# EAGLE schematic dcy.vca.v1.0.0 (EAGLE 7.7.0)
VCA
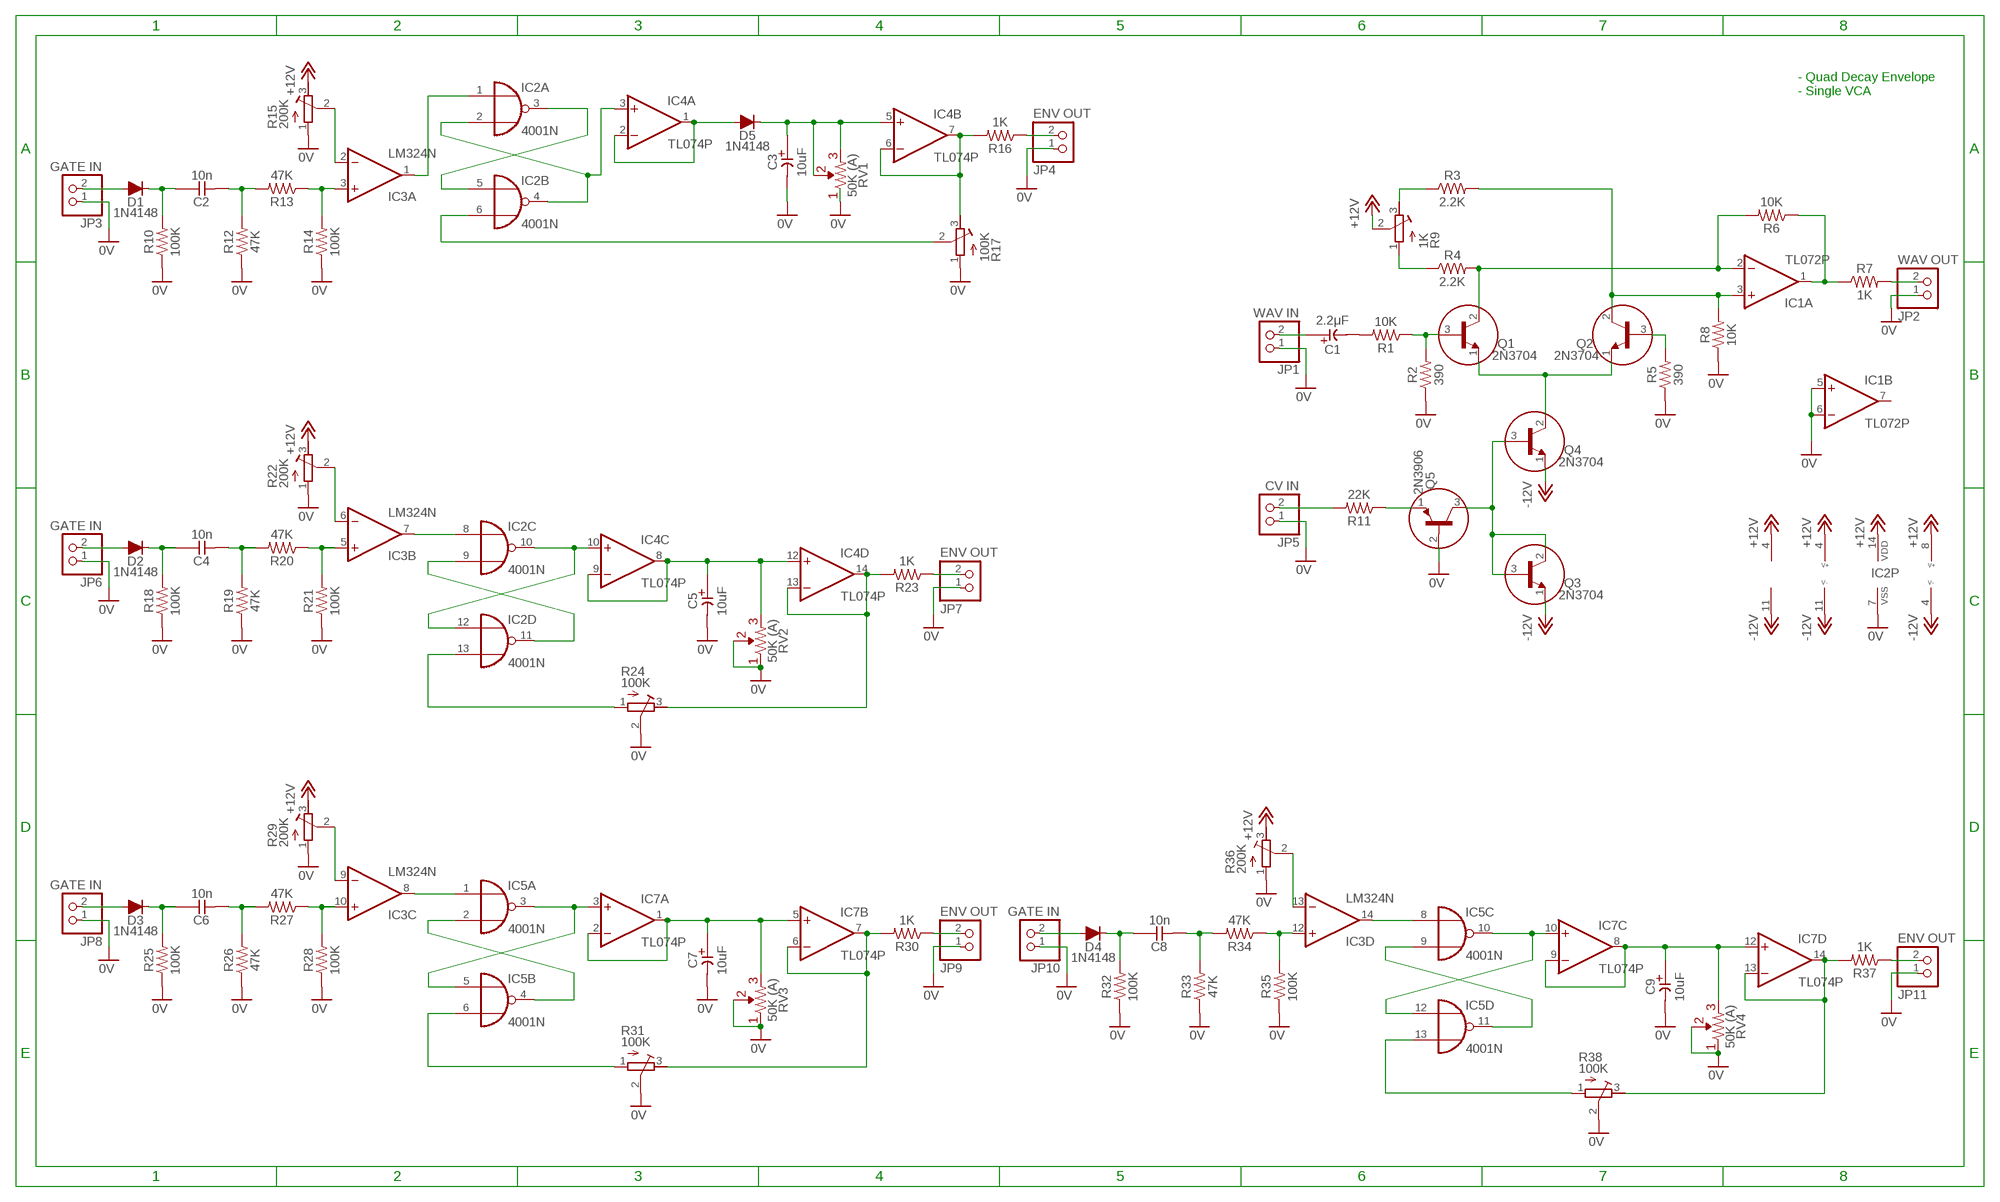
[diagram p0: schematic, sheet 1]

## Parts
C1  2.2μF  CE-USE2-5  [E2-5]
C2  10n  CC-US025-024X044  [C025-024X044]
C3  10uF  CE-USE2-5  [E2-5]
C4  10n  CC-US025-024X044  [C025-024X044]
C5  10uF  CE-USE2-5  [E2-5]
C6  10n  CC-US025-024X044  [C025-024X044]
C7  10uF  CE-USE2-5  [E2-5]
C8  10n  CC-US025-024X044  [C025-024X044]
C9  10uF  CE-USE2-5  [E2-5]
D1  1N4148  [DO35-7]
D2  1N4148  [DO35-7]
D3  1N4148  [DO35-7]
D4  1N4148  [DO35-7]
D5  1N4148  [DO35-7]
IC1  TL072P  [DIL08]
IC2  4001N  [DIL14]
IC3  LM324N  [DIL14]
IC4  TL074P  [DIL14]
IC5  4001N  [DIL14]
IC7  TL074P  [DIL14]
JP1  WAV IN  PINHD-1X2  [1X02]
JP2  WAV OUT  PINHD-1X2  [1X02]
JP3  GATE IN  PINHD-1X2  [1X02]
JP4  ENV OUT  PINHD-1X2  [1X02]
JP5  CV IN  PINHD-1X2  [1X02]
JP6  GATE IN  PINHD-1X2  [1X02]
JP7  ENV OUT  PINHD-1X2  [1X02]
JP8  GATE IN  PINHD-1X2  [1X02]
JP9  ENV OUT  PINHD-1X2  [1X02]
JP10  GATE IN  PINHD-1X2  [1X02]
JP11  ENV OUT  PINHD-1X2  [1X02]
Q1  2N3704  [TO92]
Q2  2N3704  [TO92]
Q3  2N3704  [TO92]
Q4  2N3704  [TO92]
Q5  2N3906  [TO92]
R1  10K  R0309/10  [0309/10]
R2  390  R0309/10  [0309/10]
R3  2.2K  R0309/10  [0309/10]
R4  2.2K  R0309/10  [0309/10]
R5  390  R0309/10  [0309/10]
R6  10K  R0309/10  [0309/10]
R7  1K  R0309/10  [0309/10]
R8  10K  R0309/10  [0309/10]
R9  1K  R-TRIMM3339P  [RTRIM3339P]
R10  100K  R0309/10  [0309/10]
R11  22K  R0309/10  [0309/10]
R12  47K  R0309/10  [0309/10]
R13  47K  R0309/10  [0309/10]
R14  100K  R0309/10  [0309/10]
R15  200K  R-TRIMM3339P  [RTRIM3339P]
R16  1K  R0309/10  [0309/10]
R17  100K  R-TRIMM3339P  [RTRIM3339P]
R18  100K  R0309/10  [0309/10]
R19  47K  R0309/10  [0309/10]
R20  47K  R0309/10  [0309/10]
R21  100K  R0309/10  [0309/10]
R22  200K  R-TRIMM3339P  [RTRIM3339P]
R23  1K  R0309/10  [0309/10]
R24  100K  R-TRIMM3339P  [RTRIM3339P]
R25  100K  R0309/10  [0309/10]
R26  47K  R0309/10  [0309/10]
R27  47K  R0309/10  [0309/10]
R28  100K  R0309/10  [0309/10]
R29  200K  R-TRIMM3339P  [RTRIM3339P]
R30  1K  R0309/10  [0309/10]
R31  100K  R-TRIMM3339P  [RTRIM3339P]
R32  100K  R0309/10  [0309/10]
R33  47K  R0309/10  [0309/10]
R34  47K  R0309/10  [0309/10]
R35  100K  R0309/10  [0309/10]
R36  200K  R-TRIMM3339P  [RTRIM3339P]
R37  1K  R0309/10  [0309/10]
R38  100K  R-TRIMM3339P  [RTRIM3339P]
RV1  50K (A)  R-VAR  [R-VAR]
RV2  50K (A)  R-VAR  [R-VAR]
RV3  50K (A)  R-VAR  [R-VAR]
RV4  50K (A)  R-VAR  [R-VAR]

## Nets
0V: C3.- C5.- C7.- C9.- IC1.5(B:+IN) IC1.6(B:-IN) IC2.7(P:VSS) JP1.1 JP2.1 JP3.1 JP4.1 JP5.1 JP6.1 JP7.1 JP8.1 JP9.1 JP10.1 JP11.1 Q5.2(B) R2.1 R5.1 R8.1 R10.1 R12.1 R14.1 R15.1(A) R17.1(A) R18.1 R19.1 R21.1 R22.1(A) R24.2(S) R25.1 R26.1 R28.1 R29.1(A) R31.2(S) R32.1 R33.1 R35.1 R36.1(A) R38.2(S) RV1.R1 RV2.R1 RV2.VAR RV3.R1 RV3.VAR RV4.R1 RV4.VAR
+12V: IC1.8(P:V+) IC2.14(P:VDD) IC3.4(P:V+) IC4.4(P:V+) R9.2(S) R15.3(E) R22.3(E) R29.3(E) R36.3(E)
-12V: IC1.4(P:V-) IC3.11(P:V-) IC4.11(P:V-) Q3.1(E) Q4.1(E)
N$1: C1.+ JP1.2
N$2: C1.- R1.2
N$3: JP2.2 R7.2
N$4: IC2.3(A:O) IC2.5(B:I0)
N$5: Q1.3(B) R1.1 R2.2
N$6: R4.1 R9.1(A)
N$7: R3.1 R9.3(E)
N$8: IC1.3(A:+IN) Q2.2(C) R3.2 R8.2
N$9: IC1.2(A:-IN) Q1.2(C) R4.2 R6.2
N$10: Q2.3(B) R5.2
N$11: Q1.1(E) Q2.1(E) Q4.2(C)
N$12: Q5.1(E) R11.1
N$13: IC1.1(A:OUT) R6.1 R7.1
N$14: IC2.2(A:I1) IC2.4(B:O) IC4.3(A:+IN)
N$15: D1.A JP3.2
N$16: Q3.2(C) Q3.3(B) Q4.3(B) Q5.3(C)
N$17: D5.A IC4.1(A:OUT) IC4.2(A:-IN)
N$18: C2.1 D1.C R10.2
N$19: C2.2 R12.2 R13.2
N$20: IC3.3(A:+IN) R13.1 R14.2
N$21: IC3.2(A:-IN) R15.2(S)
N$22: IC2.1(A:I0) IC3.1(A:OUT)
N$23: IC4.6(B:-IN) IC4.7(B:OUT) R16.2 R17.3(E)
N$24: JP4.2 R16.1
N$25: IC2.6(B:I1) R17.2(S)
N$26: JP5.2 R11.2
N$27: IC2.10(C:O) IC2.12(D:I0) IC4.10(C:+IN)
N$28: IC2.9(C:I1) IC2.11(D:O)
N$29: D2.A JP6.2
N$30: C4.1 D2.C R18.2
N$31: C4.2 R19.2 R20.2
N$32: IC3.5(B:+IN) R20.1 R21.2
N$33: IC3.6(B:-IN) R22.2(S)
N$34: IC2.8(C:I0) IC3.7(B:OUT)
N$35: C5.+ IC4.8(C:OUT) IC4.9(C:-IN) IC4.12(D:+IN) RV2.R2
N$36: IC4.13(D:-IN) IC4.14(D:OUT) R23.2 R24.3(E)
N$37: JP7.2 R23.1
N$38: IC2.13(D:I1) R24.1(A)
N$39: IC5.3(A:O) IC5.5(B:I0) IC7.3(A:+IN)
N$40: IC5.2(A:I1) IC5.4(B:O)
N$41: D3.A JP8.2
N$42: C6.1 D3.C R25.2
N$43: C6.2 R26.2 R27.2
N$44: IC3.10(C:+IN) R27.1 R28.2
N$45: IC3.9(C:-IN) R29.2(S)
N$46: IC3.8(C:OUT) IC5.1(A:I0)
N$47: C7.+ IC7.1(A:OUT) IC7.2(A:-IN) IC7.5(B:+IN) RV3.R2
N$48: IC7.6(B:-IN) IC7.7(B:OUT) R30.2 R31.3(E)
N$49: JP9.2 R30.1
N$50: IC5.6(B:I1) R31.1(A)
N$51: IC5.10(C:O) IC5.12(D:I0) IC7.10(C:+IN)
N$52: IC5.9(C:I1) IC5.11(D:O)
N$53: D4.A JP10.2
N$54: C8.1 D4.C R32.2
N$55: C8.2 R33.2 R34.2
N$56: IC3.12(D:+IN) R34.1 R35.2
N$57: IC3.13(D:-IN) R36.2(S)
N$58: IC3.14(D:OUT) IC5.8(C:I0)
N$59: C9.+ IC7.8(C:OUT) IC7.9(C:-IN) IC7.12(D:+IN) RV4.R2
N$60: IC7.13(D:-IN) IC7.14(D:OUT) R37.2 R38.3(E)
N$61: JP11.2 R37.1
N$62: IC5.13(D:I1) R38.1(A)
N$63: C3.+ D5.C IC4.5(B:+IN) RV1.R2 RV1.VAR
Unconnected: IC1.7(B:OUT)

## Notes on the sheet
- - Quad Decay Envelope
  - Single VCA

## Power pins joined to a net without a drawn wire
V+: IC7.4(P:V+)
V-: IC7.11(P:V-)
VDD: IC5.14(P:VDD)
VSS: IC5.7(P:VSS)

## Library data of the parts
C1 C3 C5 C7 C9 = _common:CE-US: ELECTROLYTIC CAPACITOR, US symbol
C2 C4 C6 C8 = _common:CC-US: CAPACITOR, US symbol
D1-D5 = _common:1N4148: DIODE high speed (Philips)
IC1 = _common:TL072: OP AMP
IC2 IC5 = 40xx:4001: Quad 2-input NOR
IC3 = linear:LM324: OP AMP
IC4 IC7 = _common:TL074: OP AMP
JP1-JP11 = pinhead:PINHD-1X2: PIN HEADER
Q1-Q4 = _common:2N3704
Q5 = _common:2N3906: PNP Transistor
R1-R8 R10-R14 R16 R18-R21 R23 R25-R28 R30 R32-R35 R37 = _common:R: RESISTOR, US symbol
R9 R15 R17 R22 R24 R29 R31 R36 R38 = rcl:R-TRIMM: Trimm resistor
RV1-RV4 = _common:R-VAR